# Altium project ADC_Sensor_Unit_board.PrjPcb
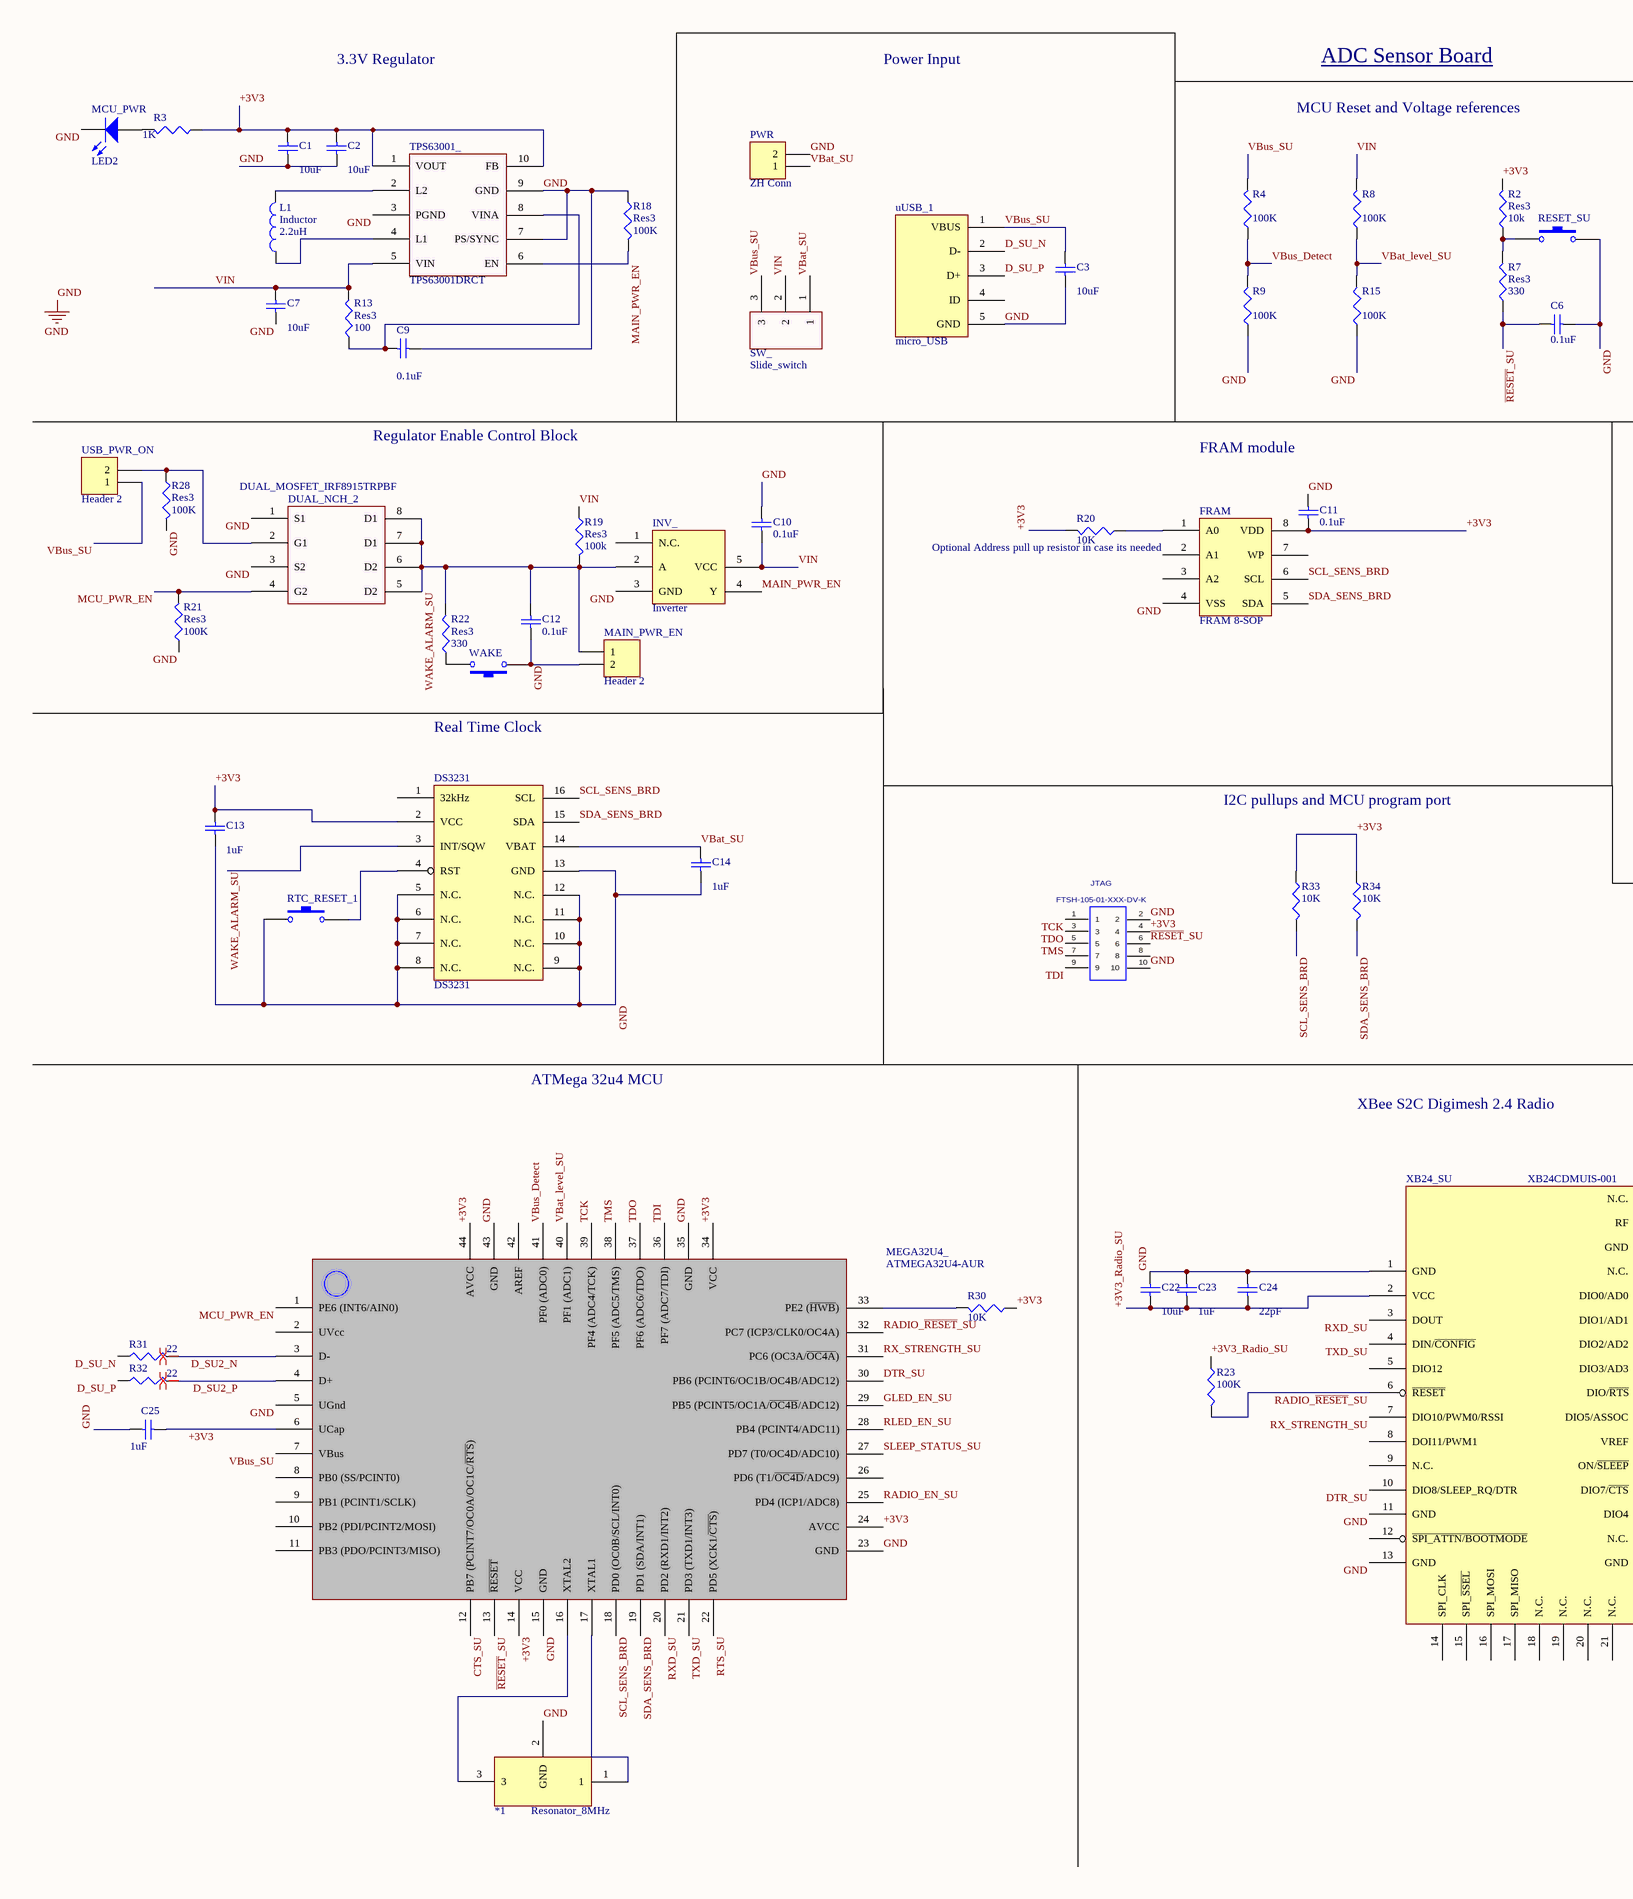
[diagram p0: ADC_Sensor_Unit_board.SchDoc, left]
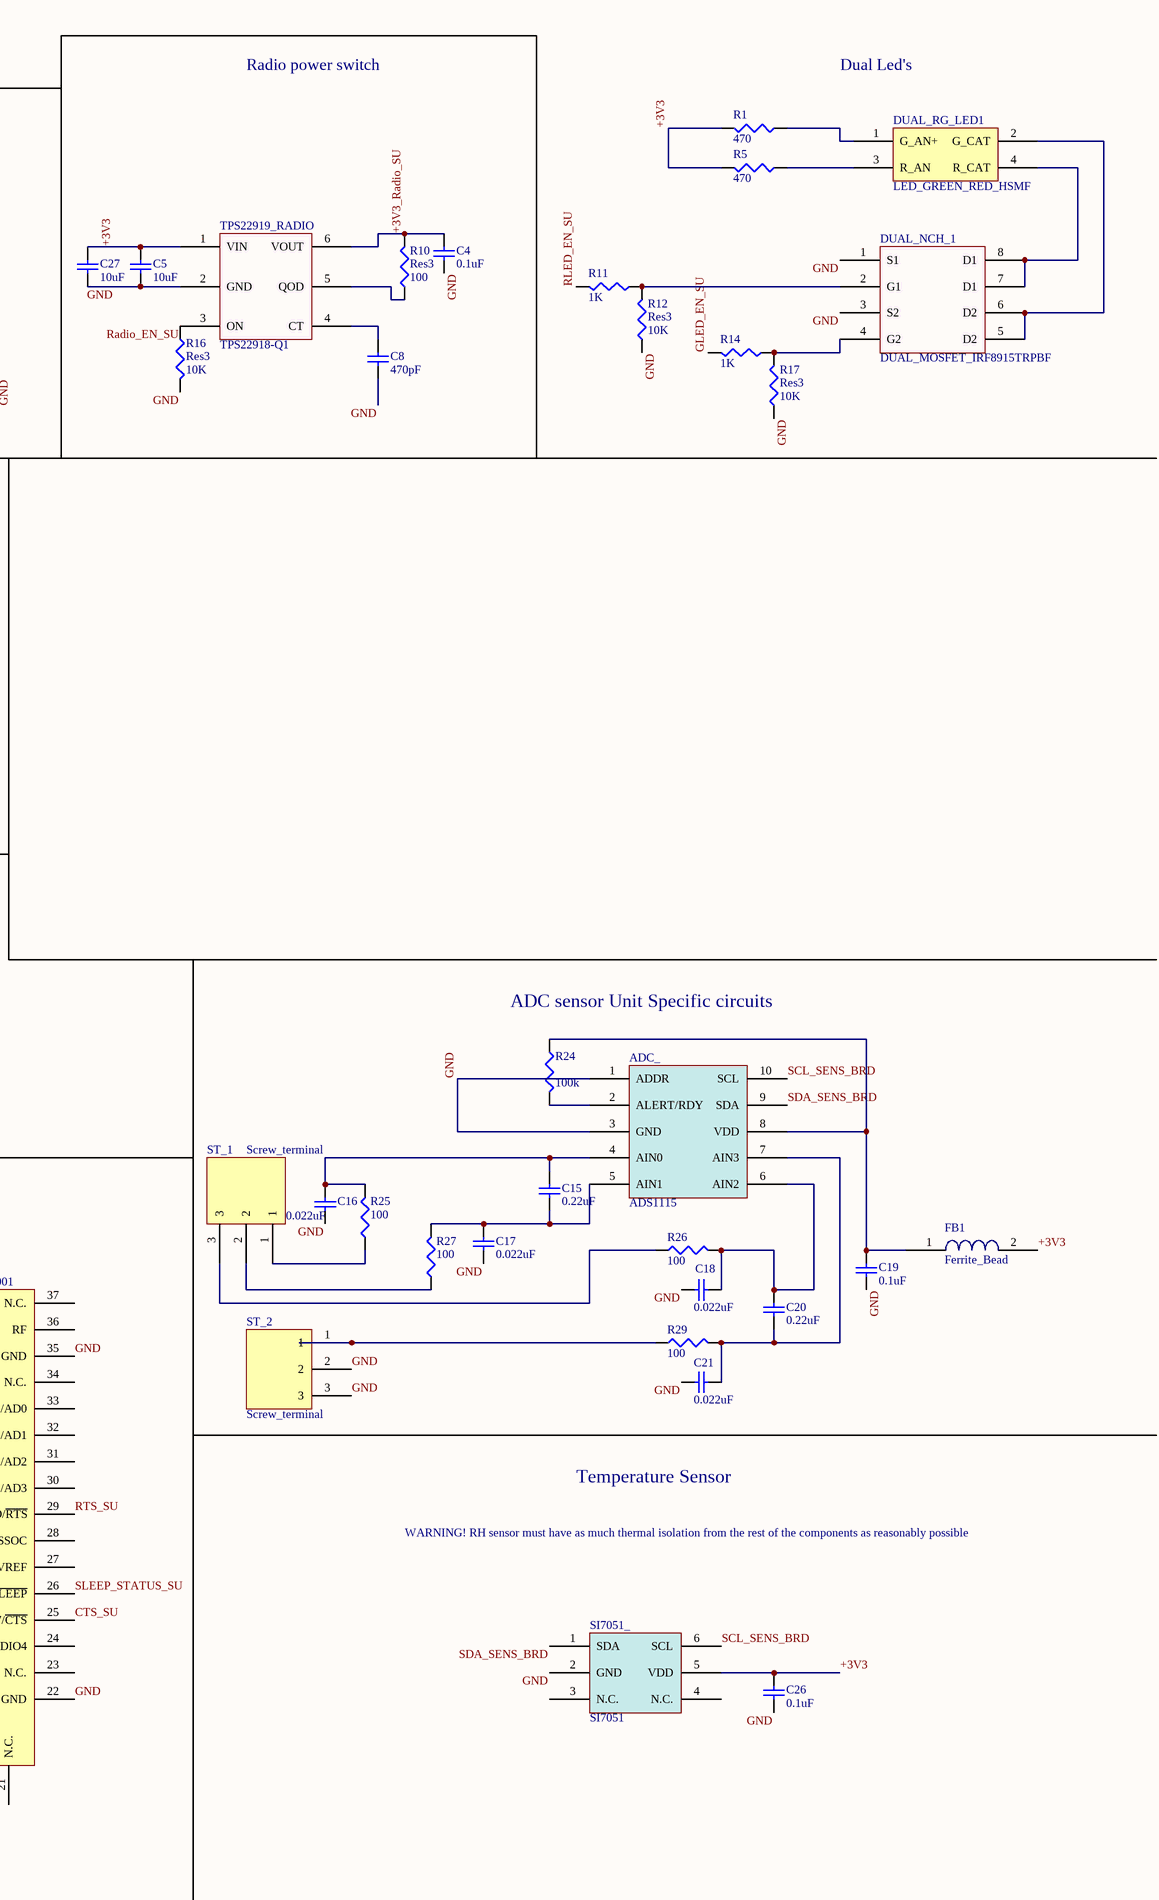
[diagram p1: ADC_Sensor_Unit_board.SchDoc, right]
1 sheet, 87 parts. Net scope: global (net labels, ports and power ports of the same name join across sheets).
Board file: ADC_Sensor_Unit_board.PcbDoc

## Sheet ADC_Sensor_Unit_board.SchDoc
size A2

### Parts
*1  Resonator_8MHz  [Resonator_8MHz]
ADC_  ADS1115  [VSSOP10]
C1  value 10uF  [1608[0603]]  (hidden comment: Cap Semi)
C2  value 10uF  [1608[0603]]  (hidden comment: Cap Semi)
C3  value 10uF  [1608[0603]]  (hidden comment: Cap Semi)
C4  value 0.1uF  [C0805]  (hidden comment: Cap Semi)
C5  value 10uF  [C0805]  (hidden comment: Cap Semi)
C6  value 0.1uF  [C0805]  (hidden comment: Cap Semi)
C7  value 10uF  [1608[0603]]  (hidden comment: Cap Semi)
C8  value 470pF  [C0805]  (hidden comment: Cap Semi)
C9  value 0.1uF  [C0805]  (hidden comment: Cap Semi)
C10  value 0.1uF  [C0805]  (hidden comment: Cap Semi)
C11  value 0.1uF  [C0805]  (hidden comment: Cap Semi)
C12  value 0.1uF  [C0805]  (hidden comment: Cap Semi)
C13  value 1uF  [C0805]  (hidden comment: Cap Semi)
C14  value 1uF  [C0805]  (hidden comment: Cap Semi)
C15  value 0.22uF  [C0805]  (hidden comment: Cap Semi)
C16  value 0.022uF  [C0805]  (hidden comment: Cap Semi)
C17  value 0.022uF  [C0805]  (hidden comment: Cap Semi)
C18  value 0.022uF  [C0805]  (hidden comment: Cap Semi)
C19  value 0.1uF  [C0805]  (hidden comment: Cap Semi)
C20  value 0.22uF  [C0805]  (hidden comment: Cap Semi)
C21  value 0.022uF  [C0805]  (hidden comment: Cap Semi)
C22  value 10uF  [1608[0603]]  (hidden comment: Cap Semi)
C23  value 1uF  [C0805]  (hidden comment: Cap Semi)
C24  value 22pF  [1608[0603]]  (hidden comment: Cap Semi)
C25  value 1uF  [C0805]  (hidden comment: Cap Semi)
C26  value 0.1uF  [C0805]  (hidden comment: Cap Semi)
C27  value 10uF  [C0805]  (hidden comment: Cap Semi)
DS3231  DS3231  [16 SO]
DUAL_NCH_1  DUAL_MOSFET_IRF8915TRPBF  [SOP-8]
DUAL_NCH_2  DUAL_MOSFET_IRF8915TRPBF  [SOP-8]
DUAL_RG_LED1  LED_GREEN_RED_HSMF  [LED4]
FB1  Ferrite_Bead  [FERRITE_BEAD]
FRAM  FRAM 8-SOP  [SOP-8]
INV_  Inverter  [SOT-23]
JTAG  FTSH-105-01-XXX-DV-K  [FTSH-105-01-XXX-DV-K]
L1  Inductor  value 2.2uH  [2.2uH_Inductor]
MAIN_PWR_EN  Header 2  [HDR1X2]
MCU_PWR  LED2  [LED_Single_Orange]
MEGA32U4_  ATMEGA32U4-AUR  [Quad44]
PWR  ZH Conn  [ZH Series Header - 2 Position]
R1  value 470  [6-0805_N]  (hidden comment: Res3)
R2  Res3  value 10k  [6-0805_N]
R3  value 1K  [6-0805_N]  (hidden comment: Res3)
R4  value 100K  [6-0805_N]  (hidden comment: Res3)
R5  value 470  [6-0805_N]  (hidden comment: Res3)
R7  Res3  value 330  [6-0805_N]
R8  value 100K  [6-0805_N]  (hidden comment: Res3)
R9  value 100K  [6-0805_N]  (hidden comment: Res3)
R10  Res3  value 100  [6-0805_N]
R11  value 1K  [6-0805_N]  (hidden comment: Res3)
R12  Res3  value 10K  [6-0805_N]
R13  Res3  value 100  [6-0805_N]
R14  value 1K  [6-0805_N]  (hidden comment: Res3)
R15  value 100K  [6-0805_N]  (hidden comment: Res3)
R16  Res3  value 10K  [6-0805_N]
R17  Res3  value 10K  [6-0805_N]
R18  Res3  value 100K  [6-0805_N]
R19  Res3  value 100k  [6-0805_N]
R20  value 10K  [6-0805_N]  (hidden comment: Res3)
R21  Res3  value 100K  [6-0805_N]
R22  Res3  value 330  [6-0805_N]
R23  value 100K  [6-0805_N]  (hidden comment: Res3)
R24  value 100k  [6-0805_N]  (hidden comment: Res3)
R25  value 100  [6-0805_N]  (hidden comment: Res3)
R26  value 100  [6-0805_N]  (hidden comment: Res3)
R27  value 100  [6-0805_N]  (hidden comment: Res3)
R28  Res3  value 100K  [6-0805_N]
R29  value 100  [6-0805_N]  (hidden comment: Res3)
R30  value 10K  [6-0805_N]  (hidden comment: Res3)
R31  value 22  [6-0805_N]  (hidden comment: Res3)
R32  value 22  [6-0805_N]  (hidden comment: Res3)
R33  value 10K  [6-0805_N]  (hidden comment: Res3)
R34  value 10K  [6-0805_N]  (hidden comment: Res3)
RESET_SU  SW-PB  [SW_TACTILE]  (value not drawn)
RTC_RESET_1  SW-PB  [SW_TACTILE]  (value not drawn)
SI7051_  SI7051  [SI7051 - small]
ST_1  Screw_terminal  [Screw Terminal]
ST_2  Screw_terminal  [Screw Terminal]
SW_  Slide_switch  [Slide_SW]
TPS22919_RADIO  TPS22918-Q1  [SOT-23-6]
TPS63001_  TPS63001DRCT  [SON10 - small]
USB_PWR_ON  Header 2  [HDR1X2]
uUSB_1  micro_USB  [MicroUSB_CONN]
WAKE  SW-PB  [SW_TACTILE]  (value not drawn)
XB24_SU  XB24CDMUIS-001  [XB24_RADIO]

### Nets
GND: *1.2(GND) ADC_.1(ADDR) ADC_.3(GND) C1.2 C2.2 C3.1 C4.2 C5.2 C6.1 C7.1 C8.2 C9.1 C10.1 C11.1 C12.2 C13.1 C14.1 C16.2 C17.2 C18.2 C19.2 C21.2 C22.2 C23.2 C24.2 C25.1 C26.1 C27.2 DS3231.5(N.C.) DS3231.6(N.C.) DS3231.7(N.C.) DS3231.8(N.C.) DS3231.9(N.C.) DS3231.10(N.C.) DS3231.11(N.C.) DS3231.12(N.C.) DS3231.13(GND) DUAL_NCH_1.1(S1) DUAL_NCH_1.3(S2) DUAL_NCH_2.1(S1) DUAL_NCH_2.3(S2) FRAM.4(VSS) INV_.3(GND) JTAG.2 JTAG.10 MAIN_PWR_EN.2 MCU_PWR.2(K) MEGA32U4_.5(UGnd) MEGA32U4_.15(GND) MEGA32U4_.23(GND) MEGA32U4_.35(GND) MEGA32U4_.43(GND) PWR.2 R9.1 R12.1 R15.1 R16.2 R17.1 R18.1 R21.1 R28.2 RESET_SU.2 RTC_RESET_1.1 SI7051_.2(GND) ST_2.2 ST_2.3 TPS22919_RADIO.2(GND) TPS63001_.3(PGND) TPS63001_.7(PS/SYNC) TPS63001_.9(GND) uUSB_1.5(GND) WAKE.1 XB24_SU.1(GND) XB24_SU.11(GND) XB24_SU.13(GND) XB24_SU.22(GND) XB24_SU.35(GND)
+3V3: C1.1 C2.1 C5.1 C11.2 C13.2 C25.2 C26.2 C27.1 DS3231.2(VCC) FB1.2 FRAM.8(VDD) JTAG.4 MEGA32U4_.6(UCap) MEGA32U4_.14(VCC) MEGA32U4_.24(AVCC) MEGA32U4_.34(VCC) MEGA32U4_.44(AVCC) R1.2 R2.2 R3.1 R5.2 R20.2 R30.1 R33.1 R34.1 SI7051_.5(VDD) TPS22919_RADIO.1(VIN) TPS63001_.1(VOUT) TPS63001_.10(FB)
+3V3_Radio_SU: C4.1 C22.1 C23.1 C24.1 R10.2 R23.1 TPS22919_RADIO.6(VOUT) XB24_SU.2(VCC)
CTS_SU: MEGA32U4_.12(PB7_(PCINT7/OC0A/OC1C/~{RTS})) XB24_SU.25(DIO7/~{CTS})
D_SU2_N: MEGA32U4_.3(D-) R31.2
D_SU2_P: MEGA32U4_.4(D+) R32.2
D_SU_N: R31.1 uUSB_1.2(D-)
D_SU_P: R32.1 uUSB_1.3(D+)
DTR_SU: MEGA32U4_.30(PB6_(PCINT6/OC1B/OC4B/ADC12)) XB24_SU.10(DIO8/SLEEP_RQ/DTR)
GLED_EN_SU: MEGA32U4_.29(PB5_(PCINT5/OC1A/~{OC4B}/ADC12)) R14.2
MAIN_PWR_EN: INV_.4(Y) R18.2 TPS63001_.6(EN)
MCU_PWR_EN: DUAL_NCH_2.4(G2) MEGA32U4_.1(PE6_(INT6/AIN0)) R21.2
~{RESET}_SU: C6.2 JTAG.6 MEGA32U4_.13(~{RESET}) R7.1
Radio_EN_SU: MEGA32U4_.25(PD4_(ICP1/ADC8)) R16.1 TPS22919_RADIO.3(ON)
RADIO_~{RESET}_SU: MEGA32U4_.32(PC7_(ICP3/CLK0/OC4A)) R23.2 XB24_SU.6(~{RESET})
RLED_EN_SU: MEGA32U4_.28(PB4_(PCINT4/ADC11)) R11.2
RTS_SU: MEGA32U4_.22(PD5_(XCK1/~{CTS})) XB24_SU.29(DIO/~{RTS})
RX_STRENGTH_SU: MEGA32U4_.31(PC6_(OC3A/~{OC4A})) XB24_SU.7(DIO10/PWM0/RSSI)
RXD_SU: MEGA32U4_.20(PD2_(RXD1/INT2)) XB24_SU.3(DOUT)
SCL_SENS_BRD: ADC_.10(SCL) DS3231.16(SCL) FRAM.6(SCL) MEGA32U4_.18(PD0_(OC0B/SCL/INT0)) R33.2 SI7051_.6(SCL)
SDA_SENS_BRD: ADC_.9(SDA) DS3231.15(SDA) FRAM.5(SDA) MEGA32U4_.19(PD1_(SDA/INT1)) R34.2 SI7051_.1(SDA)
SLEEP_STATUS_SU: MEGA32U4_.27(PD7_(T0/OC4D/ADC10)) XB24_SU.26(ON/~{SLEEP})
TCK: JTAG.1 MEGA32U4_.39(PF4_(ADC4/TCK))
TDI: JTAG.9 MEGA32U4_.36(PF7_(ADC7/TDI))
TDO: JTAG.3 MEGA32U4_.37(PF6_(ADC6/TDO))
TMS: JTAG.5 MEGA32U4_.38(PF5_(ADC5/TMS))
TXD_SU: MEGA32U4_.21(PD3_(TXD1/INT3)) XB24_SU.4(DIN/~{CONFIG})
VBat_level_SU: MEGA32U4_.40(PF1_(ADC1)) R8.1 R15.2
VBat_SU: C14.2 DS3231.14(VBAT) PWR.1 SW_.1
VBus_Detect: MEGA32U4_.41(PF0_(ADC0)) R4.1 R9.2
VBus_SU: C3.2 MEGA32U4_.7(VBus) R4.2 SW_.3 USB_PWR_ON.1 uUSB_1.1(VBUS)
VIN: C7.2 C10.2 INV_.5(VCC) R8.2 R13.2 R19.1 SW_.2 TPS63001_.5(VIN)
WAKE_ALARM_SU: C12.1 DS3231.3(INT/SQW) DUAL_NCH_2.5(D2) DUAL_NCH_2.6(D2) DUAL_NCH_2.7(D1) DUAL_NCH_2.8(D1) INV_.2(A) MAIN_PWR_EN.1 R19.2 R22.2
Net*1_1: *1.1 MEGA32U4_.17(XTAL1)
Net*1_3: *1.3 MEGA32U4_.16(XTAL2)
NetADC__2: ADC_.2(ALERT/RDY) R24.2
NetADC__4: ADC_.4(AIN0) C15.2 C16.1 R25.2
NetADC__5: ADC_.5(AIN1) C15.1 C17.1 R27.2
NetADC__6: ADC_.6(AIN2) C18.1 C20.2 R26.2
NetADC__7: ADC_.7(AIN3) C20.1 C21.1 R29.2
NetADC__8: ADC_.8(VDD) C19.1 FB1.1 R24.1
NetC8_1: C8.1 TPS22919_RADIO.4(CT)
NetC9_2: C9.2 R13.1 TPS63001_.8(VINA)
NetDS3231_4: DS3231.4(RST) RTC_RESET_1.2
NetDUAL_NCH_1_2: DUAL_NCH_1.2(G1) R11.1 R12.2
NetDUAL_NCH_1_4: DUAL_NCH_1.4(G2) R14.1 R17.2
NetDUAL_NCH_1_5: DUAL_NCH_1.5(D2) DUAL_NCH_1.6(D2) DUAL_RG_LED1.2(G_CAT)
NetDUAL_NCH_1_7: DUAL_NCH_1.7(D1) DUAL_NCH_1.8(D1) DUAL_RG_LED1.4(R_CAT)
NetDUAL_NCH_2_2: DUAL_NCH_2.2(G1) R28.1 USB_PWR_ON.2
NetDUAL_RG_LED1_1: DUAL_RG_LED1.1(G_AN+) R1.1
NetDUAL_RG_LED1_3: DUAL_RG_LED1.3(R_AN) R5.1
NetFRAM_1: FRAM.1(A0) R20.1
NetL1_1: L1.1 TPS63001_.4(L1)
NetL1_2: L1.2 TPS63001_.2(L2)
NetMCU_PWR_1: MCU_PWR.1(A) R3.2
NetMEGA32U4__33: MEGA32U4_.33(PE2_(~{HWB})) R30.2
NetR2_1: R2.1 R7.2 RESET_SU.1
NetR10_1: R10.1 TPS22919_RADIO.5(QOD)
NetR22_1: R22.1 WAKE.2
NetR25_1: R25.1 ST_1.1
NetR26_1: R26.1 ST_1.3
NetR27_1: R27.1 ST_1.2
NetR29_1: R29.1 ST_2.1

Not connected (* = marked no-connect by the designer): DS3231 1(32kHz); FRAM 2(A1) 3(A2) 7(WP); INV_ 1(N.C.); JTAG 7 8; MEGA32U4_ 2(UVcc) 8(PB0_(SS/PCINT0)) 9(PB1_(PCINT1/SCLK)) 10(PB2_(PDI/PCINT2/MOSI)) 11(PB3_(PDO/PCINT3/MISO)) 26(PD6_(T1/~{OC4D}/ADC9)) 42(AREF); SI7051_ 3(N.C.) 4(N.C.); uUSB_1 4(ID); XB24_SU 5(DIO12) 8(DOI11/PWM1) 9(N.C.) 12(~{SPI_ATTN/BOOTMODE}) 14(SPI_CLK) 15(SPI_~{SSEL}) 16(SPI_MOSI) 17(SPI_MISO) 18(N.C.) 19(N.C.) 20(N.C.) 21(N.C.) 23(N.C.) 24(DIO4) 27(VREF) 28(DIO5/ASSOC) 30(DIO3/AD3) 31(DIO2/AD2) 32(DIO1/AD1) 33(DIO0/AD0) 34(N.C.) 36(RF) 37(N.C.)

### Layout directives
differential pair: D_SU2_N, D_SU2_P

### Notes on the sheet
- 3.3V Regulator
- Power Input
- ADC Sensor Board
- Radio power switch
- Dual Led's
- MCU Reset and Voltage references
- Regulator Enable Control Block
- FRAM module
- (near FRAM) Optional Address pull up resistor in case its needed
- Real Time Clock
- I2C pullups and MCU program port
- (near R24) ADC sensor Unit Specific circuits
- ATMega 32u4 MCU
- XBee S2C Digimesh 2.4 Radio
- Temperature Sensor
- WARNING! RH sensor must have as much thermal isolation from the rest of the components as reasonably possible

### Library data of the parts
C1-C27 = Cap Semi: Capacitor (Semiconductor SIM Model); Published: 8-Jun-2000; LatestRevisionDate: 29-May-2009; LatestRevisionNote: IPC-7351 Footprint Added.; PackageReference: C1206; Publisher: Altium Limited; PackageDescription: Chip Capacitor
INV_ = SN74LVC1GU04
JTAG = FTSH-105-01-XXX-DV-K: TERMINAL STRIP, .050"(1.27mm) PITCH, 10 PINS, KEYED; MANUFACTURER: SAMTEC; CREATED: November 30, 2016 - Wendy Xin; PCB DECAL: FTSH-105-01-XXX-DV-K
L1 = Inductor: Code_IEC: 1005; Published: 8-Jun-2000; LatestRevisionDate: 29-May-2009; LatestRevisionNote: IPC-7351 Footprint Added.; PackageReference: 0402-A; Publisher: Altium Limited; PackageDescription: Chip Inductor; Code_JEITA: 0402
MAIN_PWR_EN PWR USB_PWR_ON = Header 2: Header, 2-Pin; LatestRevisionDate: 17-Jul-2002; LatestRevisionNote: Re-released for DXP Platform.; Publisher: Altium Limited
MCU_PWR = LED2: Typical RED, GREEN, YELLOW, AMBER GaAs LED; Published: 8-Jun-2000; LatestRevisionDate: 17-Jul-2002; LatestRevisionNote: Re-released for DXP Platform.; PackageVersion: Feb-2002; PackageReference: 3.2X1.6X1.1; Publisher: Altium Limited; PackageDescription: SM LED; 2 Flat Leads
R1-R5 R7-R34 = Res3: Resistor; Published: 8-Jun-2000; LatestRevisionDate: 29-May-2009; LatestRevisionNote: IPC-7351 Footprint Added.; PackageReference: J1-0603; Publisher: Altium Limited; PackageDescription: Chip Resistor
RESET_SU RTC_RESET_1 WAKE = SW-PB: Switch; Published: 24-Mar-1999; LatestRevisionDate: 17-Jul-2002; LatestRevisionNote: Re-released for DXP Platform.; PackageReference: SPST-2; Publisher: Altium Limited; PackageDescription: Switch; 2 Leads